# Altium project Altium_Design_Challenge.PrjPcb (part 3 of 3)
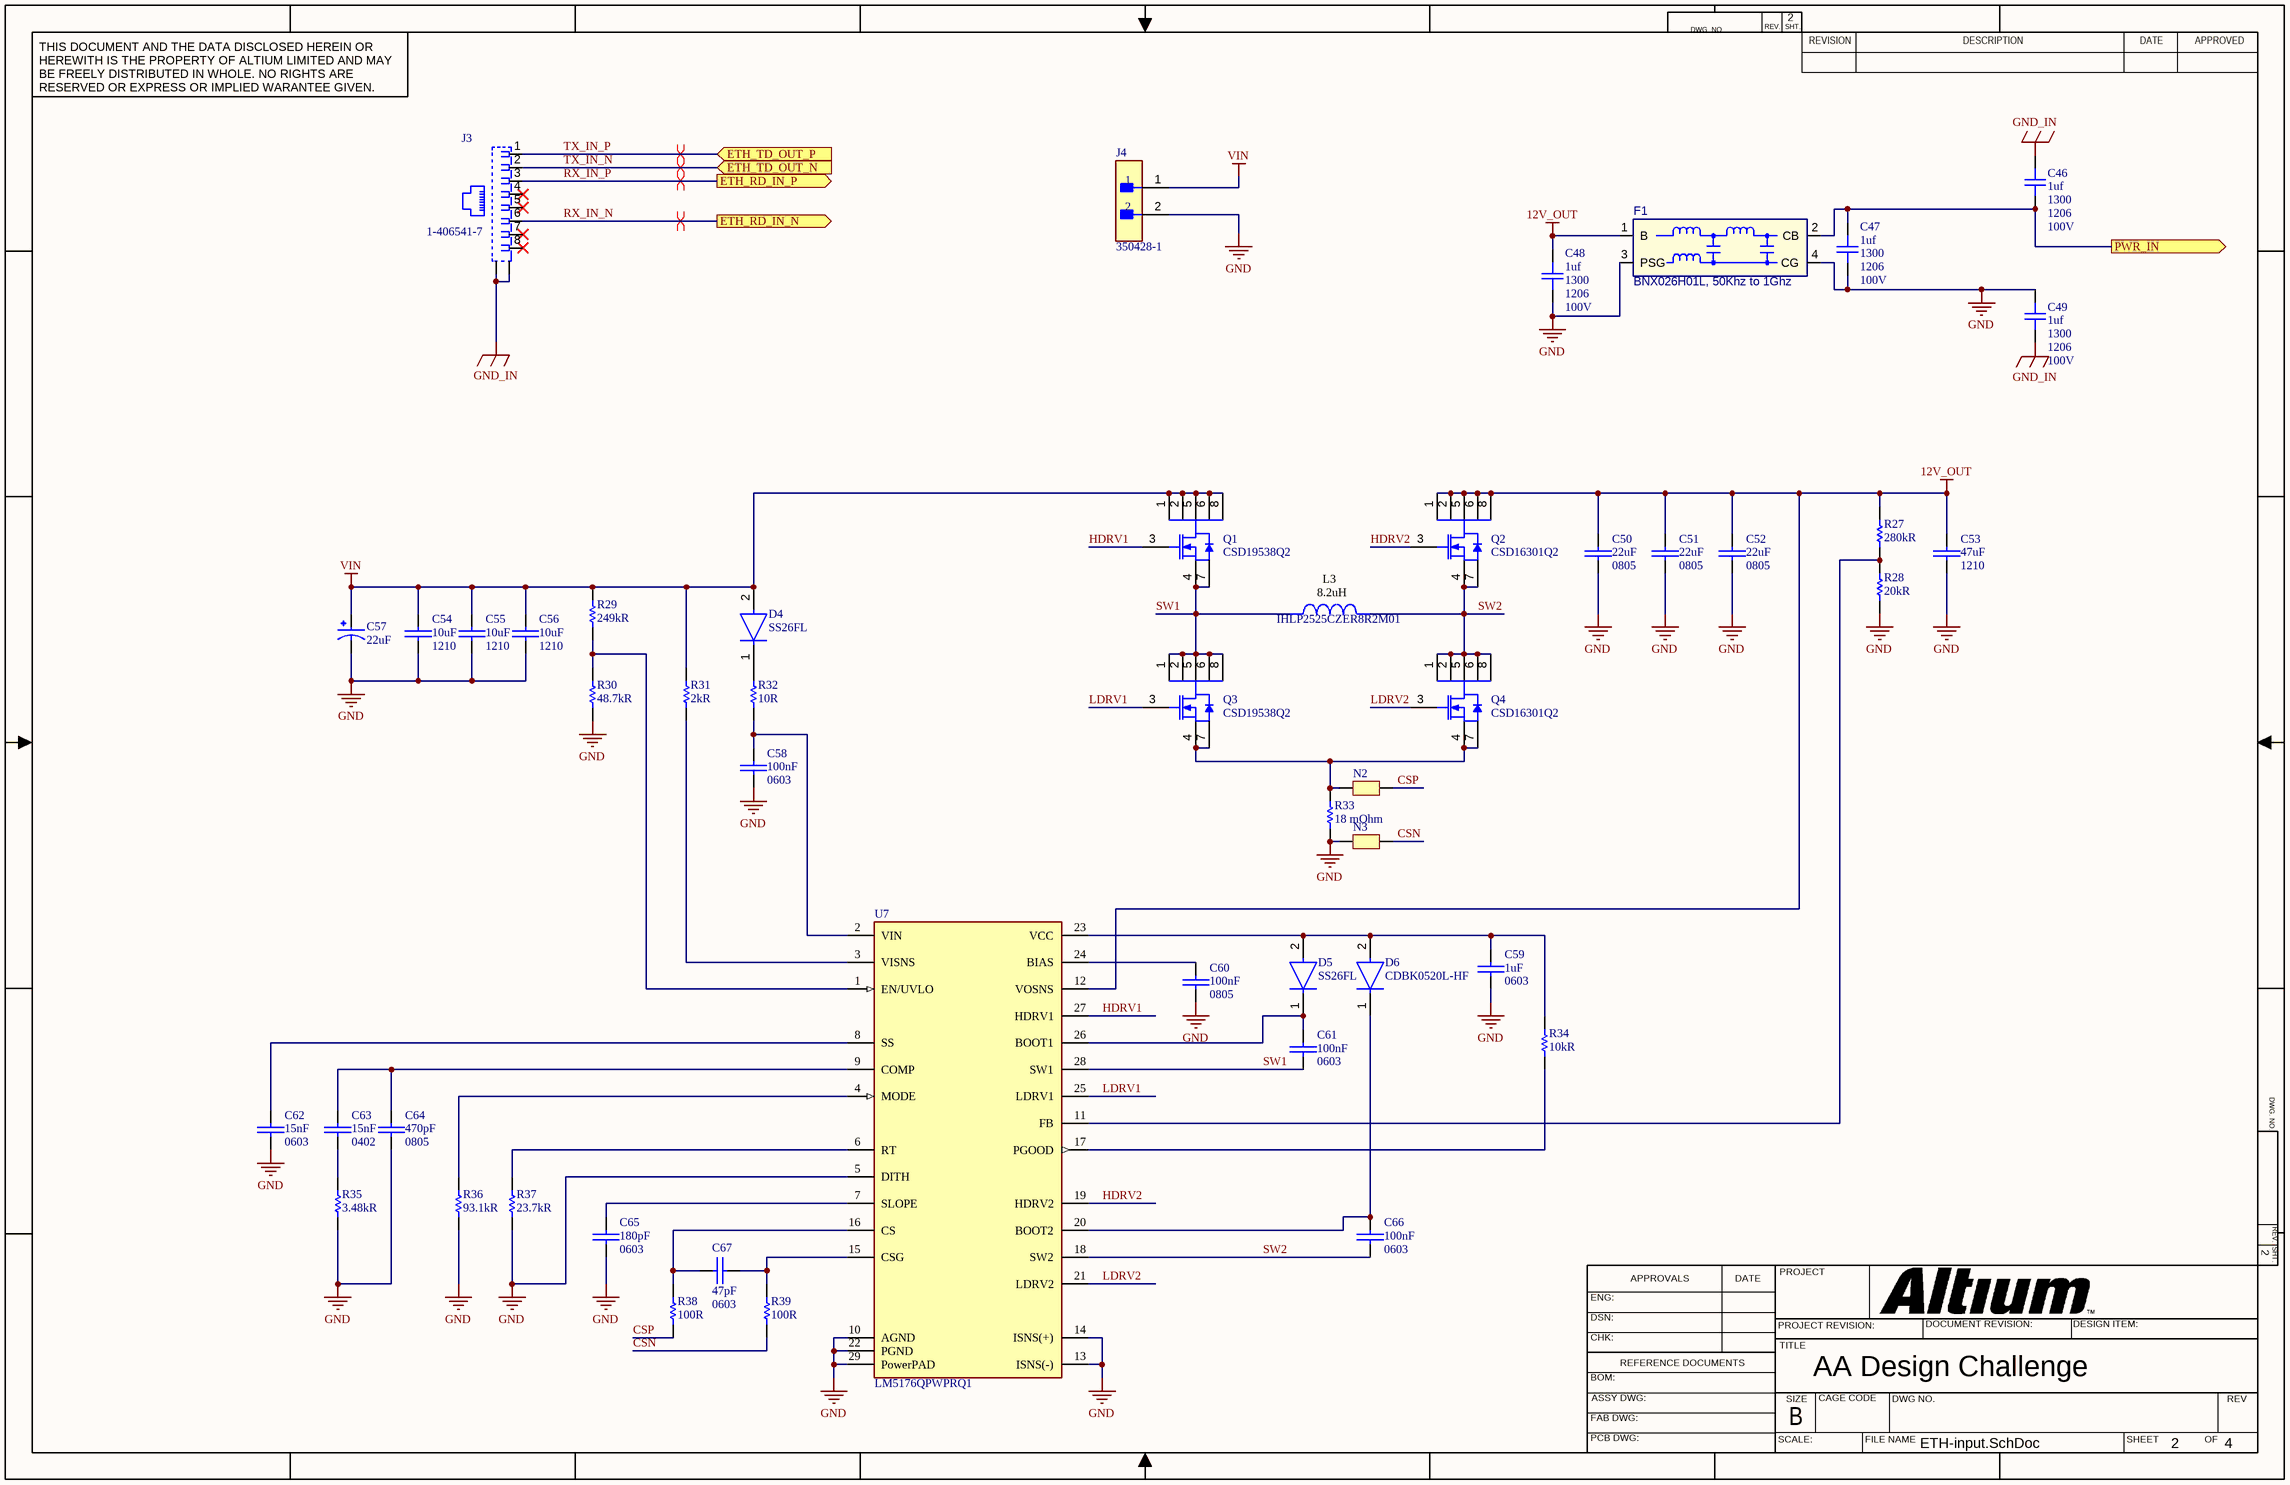
[diagram p6: ETH-input.SchDoc]

## Sheet ETH-input.SchDoc: AA Design Challenge (continued)

### Library data of the parts (continued)
R31 = RES SMD 2K OHM 1% 1/10W 0603: Res Thick Film 0603 2K Ohm 1% 1/10W ±100ppm/°C Molded SMD Paper T/R; Manufacturer: Vishay; Manufacturer Part Number: CRCW06032K00FKEB; Power Rating: 100mW; Voltage Rating: 75V; Supplier: Digi-Key; Supplier Part Number: 541-2.00KHCT-ND; RoHS: Yes; Category: Chip SMD Resistors; Stock: 30000; Pricing: 1=0.10000, 10=0.03400, 50=0.01860, 100=0.01370, 500=0.00836, 1000=0.00616 (USD); Case/Package: 0603; Pins: 2; Contact Plating: Tin; Weight: 7.1E-05oz; Case Code (Imperial): 0603; Case Code (Metric): 1608; Min Operating Temperature: -55°C; Max Operating Temperature: 155°C; Termination: SMD/SMT; Tolerance: 1%; Packaging: Tape and Reel; Package Quantity: 10; Value: 2kR; Temperature Coefficient: 100ppm/°C; Series: CRCW; Resistor Type: Thick Film; Number of Terminations: 2; Max Power Dissipation: 100mW; Features: Automotive AEC-Q200; Construction: Rectangular; Technology: THICK FILM; Voltage Rating (DC): 75V; Resistance Tolerance: 1%; Length: 1.55mm; Width: 0.033inch; Height: 0.45mm; Depth: 0.85mm; Lead Free: Lead Free; RoHS Compliant: Yes; Military Standard: Not; Reach SVHC Compliant: Unknown; ComponentLink1URL: https://datasheet.ciiva.com/28621/125364-28621397.pdf?src-supplier=Element14; ComponentLink1Description: https://datasheet.ciiva.com/28621/125364-28621397.pdf?src-supplier=Element14; ComponentLink2URL: https://datasheet.ciiva.com/7673/1720486-7673525.pdf?src-supplier=Element14; ComponentLink2Description: https://datasheet.ciiva.com/7673/1720486-7673525.pdf?src-supplier=Element14; ComponentLink3URL: https://datasheet.ciiva.com/26314/fld-crcw-e3-data-en-26314682.pdf?src-supplier=Distrelec; ComponentLink3Description: https://datasheet.ciiva.com/26314/fld-crcw-e3-data-en-26314682.pdf?src-supplier=Distrelec; ComponentLink4URL: https://datasheet.ciiva.com/2465/dcrcwe3-2465565.pdf?src-supplier=Digi-Key; ComponentLink4Description: https://datasheet.ciiva.com/2465/dcrcwe3-2465565.pdf?src-supplier=Digi-Key; ComponentLink5URL: https://datasheet.ciiva.com/2465/dcrcwe3-2465566.pdf?src-supplier=Digi-Key; ComponentLink5Description: https://datasheet.ciiva.com/2465/dcrcwe3-2465566.pdf?src-supplier=Digi-Key; ComponentLink6URL: https://datasheet.ciiva.com/2465/dcrcwe3-2465564.pdf?src-supplier=Digi-Key; ComponentLink6Description: https://datasheet.ciiva.com/2465/dcrcwe3-2465564.pdf?src-supplier=Digi-Key; ComponentLink7URL: https://datasheet.ciiva.com/16755/70201119-16755770.pdf?src-supplier=Allied+Electronics; ComponentLink7Description: https://datasheet.ciiva.com/16755/70201119-16755770.pdf?src-supplier=Allied+Electronics; ComponentLink8URL: https://datasheet.ciiva.com/16765/70201119-16765388.pdf?src-supplier=Allied+Electronics; ComponentLink8Description: https://datasheet.ciiva.com/16765/70201119-16765388.pdf?src-supplier=Allied+Electronics; ComponentLink9URL: https://datasheet.ciiva.com/5551/dcrcwe3-109170-5551994.pdf?src-supplier=Mouser; ComponentLink9Description: https://datasheet.ciiva.com/5551/dcrcwe3-109170-5551994.pdf?src-supplier=Mouser; ComponentLink10URL: https://datasheet.ciiva.com/3257/dcrcwe3-3257366.pdf?src-supplier=Avnet; ComponentLink10Description: https://datasheet.ciiva.com/3257/dcrcwe3-3257366.pdf?src-supplier=Avnet; ComponentLink11URL: https://datasheet.ciiva.com/3257/dcrcwe3-3257367.pdf?src-supplier=Avnet; ComponentLink11Description: https://datasheet.ciiva.com/3257/dcrcwe3-3257367.pdf?src-supplier=Avnet
R32 = RES SMD 2K OHM 1% 1/10W 0603: Res Thick Film 0603 10 Ohm 1% 1/10W ±200ppm/°C Molded SMD Paper T/R; Manufacturer: Yageo; Manufacturer Part Number: RC0603FR-0710RL; Voltage Rating (DC): 50V; Max Power Dissipation: 100mW; Supplier: Digi-Key; Supplier Part Number: 311-10.0HRCT-ND; RoHS: Yes; Category: Chip SMD Resistors; Stock: 3052109; Pricing: 1=0.10000, 10=0.03000, 50=0.01900, 100=0.01600, 500=0.01106, 1000=0.00957 (USD); Case/Package: 0603; Pins: 2; Case Code (Imperial): 0603; Case Code (Metric): 1608; Contact Plating: Tin,Matte; Min Operating Temperature: -55°C; Max Operating Temperature: 155°C; Packaging: Tape and Reel; Value: 10R; Tolerance: 1%; Temperature Coefficient: 200ppm/°C; Series: RC; Number of Terminations: 2; Features: Moisture Resistant; Power Rating: 100mW; Voltage Rating: 50V; Termination: SMD/SMT; Resistor Type: Thick Film; Resistance Tolerance: 1%; Construction: Rectangular; Technology: THICK FILM; Length: 1.6mm; Width: 0.8mm; Height: 0.45mm; Depth: 0.8mm; Lead Free: Lead Free; RoHS Compliant: Yes; Reach SVHC Compliant: No; Military Standard: Not; ComponentLink1URL: https://datasheet.ciiva.com/11808/0900766b80f96399-11808140.pdf?src-supplier=Rs; ComponentLink1Description: https://datasheet.ciiva.com/11808/0900766b80f96399-11808140.pdf?src-supplier=Rs; ComponentLink2URL: https://datasheet.ciiva.com/8891/pyu-rc0603-51-rohs-l-4-8891285.pdf?src-supplier=Avnet; ComponentLink2Description: https://datasheet.ciiva.com/8891/pyu-rc0603-51-rohs-l-4-8891285.pdf?src-supplier=Avnet; ComponentLink3URL: https://datasheet.ciiva.com/7746/443971-7746245.pdf?src-supplier=Element14; ComponentLink3Description: https://datasheet.ciiva.com/7746/443971-7746245.pdf?src-supplier=Element14
R33 = ERJ8CWFR018V: Res Thick Film 1206 0.018 Ohm 1% 1W ±75ppm/C Pad SMD Automotive T/R; Manufacturer: Panasonic; Manufacturer Part Number: ERJ8CWFR018V; Resistance: 18 mOhm
R34 = RES SMD 2K OHM 1% 1/10W 0603: RES SMD 10K OHM 1% 1/10W 0603; Manufacturer: Yageo; Manufacturer Part Number: RC0603FR-0710KL; Temperature Coefficient: 100ppm/°C; Voltage Rating: 75V; Voltage Rating (DC): 50V; Power Rating: 100mW; Supplier: Digi-Key; Supplier Part Number: 311-10.0KHRCT-ND; RoHS: Yes; Category: Chip SMD Resistors; Stock: 31562313; Pricing: 1=0.10000, 10=0.01900, 50=0.01140, 100=0.00940, 500=0.00628, 1000=0.00537 (USD); Case/Package: 0603; Pins: 2; Case Code (Imperial): 0603; Case Code (Metric): 1608; Weight: 7.1E-05oz; Min Operating Temperature: -55°C; Max Operating Temperature: 155°C; Tolerance: 1%; Resistor Type: Thick Film; Value: 10kR; Packaging: Tape and Reel; Termination: SMD/SMT; Features: Moisture Resistant; Series: RC; Max Power Dissipation: 100mW; Number of Terminations: 2; Resistance Tolerance: 1%; Construction: Rectangular; Length: 1.6mm; Width: 0.8mm; Height: 0.45mm; Depth: 0.8mm; Lead Pitch: 0.3mm; RoHS Compliant: Yes; Reach SVHC Compliant: No; Military Standard: Not; Lead Free: Lead Free; ComponentLink1URL: https://datasheet.ciiva.com/7660/38590-7660789.pdf?src-supplier=Element14; ComponentLink1Description: https://datasheet.ciiva.com/7660/38590-7660789.pdf?src-supplier=Element14; ComponentLink2URL: https://datasheet.ciiva.com/7983/443971-7983596.pdf?src-supplier=Element14; ComponentLink2Description: https://datasheet.ciiva.com/7983/443971-7983596.pdf?src-supplier=Element14; ComponentLink3URL: https://datasheet.ciiva.com/22747/443971-22747519.pdf?src-supplier=Element14; ComponentLink3Description: https://datasheet.ciiva.com/22747/443971-22747519.pdf?src-supplier=Element14; ComponentLink4URL: https://datasheet.ciiva.com/46440/1868787-46440891.pdf?src-supplier=Element14; ComponentLink4Description: https://datasheet.ciiva.com/46440/1868787-46440891.pdf?src-supplier=Element14; ComponentLink5URL: https://datasheet.ciiva.com/7746/1738695-7746239.pdf?src-supplier=Element14; ComponentLink5Description: https://datasheet.ciiva.com/7746/1738695-7746239.pdf?src-supplier=Element14; ComponentLink6URL: https://datasheet.ciiva.com/15189/getdatasheetpartid-409289-15189591.pdf?src-supplier=Verical; ComponentLink6Description: https://datasheet.ciiva.com/15189/getdatasheetpartid-409289-15189591.pdf?src-supplier=Verical
R35 = RES SMD 2K OHM 1% 1/10W 0603: Res Thick Film 0402 3.48K Ohm 1% 1/16W ±100ppm/°C Molded SMD Paper T/R; Manufacturer: Vishay; Manufacturer Part Number: CRCW04023K48FKED; Max Power Dissipation: 63mW; Voltage Rating: 50V; Supplier: Digi-Key; Supplier Part Number: 541-3.48KLCT-ND; RoHS: Yes; Category: Chip SMD Resistors; Stock: 10000; Pricing: 1=0.10000, 10=0.03300, 50=0.01820, 100=0.01340, 500=0.00818, 1000=0.00602, 5000=0.00432 (USD); Case/Package: 0402; Pins: 2; Weight: 2.3E-05oz; Case Code (Imperial): 0402; Case Code (Metric): 1005; Contact Plating: Tin; Min Operating Temperature: -55°C; Max Operating Temperature: 155°C; Value: 3.48kR; Tolerance: 1%; Packaging: Tape and Reel; Package Quantity: 10000; Number of Terminations: 2; Temperature Coefficient: 100ppm/°C; Features: Automotive AEC-Q200; Series: CRCW; Power Rating: 63mW; Resistor Type: Thick Film; Termination: SMD/SMT; Technology: THICK FILM; Resistance Tolerance: 1%; Length: 1mm; Width: 0.5mm; Height: 0.35mm; Depth: 0.5mm; Ratings: AEC-Q200; Radiation Hardening: No; RoHS Compliant: Yes; Reach SVHC Compliant: Unknown; ComponentLink1URL: https://datasheet.ciiva.com/11818/0900766b80d98824-11818064.pdf?src-supplier=Rs; ComponentLink1Description: https://datasheet.ciiva.com/11818/0900766b80d98824-11818064.pdf?src-supplier=Rs; ComponentLink2URL: https://datasheet.ciiva.com/3256/dcrcwe3-3256488.pdf?src-supplier=Avnet; ComponentLink2Description: https://datasheet.ciiva.com/3256/dcrcwe3-3256488.pdf?src-supplier=Avnet; ComponentLink3URL: https://datasheet.ciiva.com/3256/dcrcwe3-3256489.pdf?src-supplier=Avnet; ComponentLink3Description: https://datasheet.ciiva.com/3256/dcrcwe3-3256489.pdf?src-supplier=Avnet; ComponentLink4URL: https://datasheet.ciiva.com/2463/dcrcwe3-2463514.pdf?src-supplier=Digi-Key; ComponentLink4Description: https://datasheet.ciiva.com/2463/dcrcwe3-2463514.pdf?src-supplier=Digi-Key; ComponentLink5URL: https://datasheet.ciiva.com/2463/dcrcwe3-2463515.pdf?src-supplier=Digi-Key; ComponentLink5Description: https://datasheet.ciiva.com/2463/dcrcwe3-2463515.pdf?src-supplier=Digi-Key; ComponentLink6URL: https://datasheet.ciiva.com/2463/dcrcwe3-2463516.pdf?src-supplier=Digi-Key; ComponentLink6Description: https://datasheet.ciiva.com/2463/dcrcwe3-2463516.pdf?src-supplier=Digi-Key; ComponentLink7URL: https://datasheet.ciiva.com/5546/dcrcwe3-109170-5546917.pdf?src-supplier=Mouser; ComponentLink7Description: https://datasheet.ciiva.com/5546/dcrcwe3-109170-5546917.pdf?src-supplier=Mouser; ComponentLink8URL: https://datasheet.ciiva.com/7670/1697337-7670197.pdf?src-supplier=Element14; ComponentLink8Description: https://datasheet.ciiva.com/7670/1697337-7670197.pdf?src-supplier=Element14; ComponentLink9URL: https://datasheet.ciiva.com/7670/1697337-7670198.pdf?src-supplier=Element14; ComponentLink9Description: https://datasheet.ciiva.com/7670/1697337-7670198.pdf?src-supplier=Element14; ComponentLink10URL: https://datasheet.ciiva.com/22707/1697337-22707727.pdf?src-supplier=Element14; ComponentLink10Description: https://datasheet.ciiva.com/22707/1697337-22707727.pdf?src-supplier=Element14; ComponentLink11URL: https://datasheet.ciiva.com/16449/dcrcwe3-16449546.pdf?src-supplier=Future+Electronics; ComponentLink11Description: https://datasheet.ciiva.com/16449/dcrcwe3-16449546.pdf?src-supplier=Future+Electronics; ComponentLink12URL: https://datasheet.ciiva.com/22869/70201119-22869978.pdf?src-supplier=Allied+Electronics; ComponentLink12Description: https://datasheet.ciiva.com/22869/70201119-22869978.pdf?src-supplier=Allied+Electronics
R36 = RES SMD 2K OHM 1% 1/10W 0603: Res Thick Film 0603 93.1K Ohm 1% 1/10W ±100ppm/°C Molded SMD SMD Paper T/R; Manufacturer: Yageo; Manufacturer Part Number: RC0603FR-0793K1L; Power Rating: 100mW; Voltage Rating: 50V; Working Voltage: 75V; Supplier: Digi-Key; Supplier Part Number: 311-93.1KHRCT-ND; RoHS: Yes; Category: Chip SMD Resistors; Stock: 14645; Pricing: 1=0.10000, 10=0.01900, 50=0.01140, 100=0.00940, 500=0.00628, 1000=0.00537 (USD); Case/Package: 0603; Contact Plating: Tin,Matte; Case Code (Imperial): 0603; Case Code (Metric): 1608; Min Operating Temperature: -55°C; Max Operating Temperature: 155°C; Tolerance: 1%; Value: 93.1kR; Temperature Coefficient: 100ppm/°C; Package Quantity: 1; Packaging: Tape and Reel; Termination: SMD/SMT; Number of Terminations: 2; Max Power Dissipation: 100mW; Voltage Rating (DC): 50V; Features: Moisture Resistant; Series: RC; Technology: THICK FILM; Length: 0.063inch; Width: 0.031inch; Height: 0.022inch; Lead Free: Lead Free; RoHS Compliant: Yes; ComponentLink1URL: https://datasheet.ciiva.com/2455/pyu-r-int-thick-7-2455339.pdf?src-supplier=Digi-Key; ComponentLink1Description: https://datasheet.ciiva.com/2455/pyu-r-int-thick-7-2455339.pdf?src-supplier=Digi-Key; ComponentLink2URL: https://datasheet.ciiva.com/2455/pyu-r-int-thick-7-2455340.pdf?src-supplier=Digi-Key; ComponentLink2Description: https://datasheet.ciiva.com/2455/pyu-r-int-thick-7-2455340.pdf?src-supplier=Digi-Key; ComponentLink3URL: https://datasheet.ciiva.com/2455/pyu-r-int-thick-7-2455338.pdf?src-supplier=Digi-Key; ComponentLink3Description: https://datasheet.ciiva.com/2455/pyu-r-int-thick-7-2455338.pdf?src-supplier=Digi-Key
R37 = RES SMD 2K OHM 1% 1/10W 0603: Res General Purpose Thick Film 0201 23.7k Ohm 1% 1/20W ±200ppm/°C Molded SMD Paper T/R; Manufacturer: Yageo; Manufacturer Part Number: RC0201FR-0723K7L; Max Power Dissipation: 50mW; Supplier: Digi-Key; Supplier Part Number: YAG2524CT-ND; RoHS: Yes; Category: Chip SMD Resistors; Stock: 105811; Pricing: 1=0.10000, 10=0.02700, 50=0.01720, 100=0.01450, 500=0.00998, 1000=0.00863, 5000=0.00635 (USD); Case/Package: 0201; Case Code (Metric): 0603; Case Code (Imperial): 0201; Min Operating Temperature: -55°C; Max Operating Temperature: 125°C; Packaging: Cut Tape; Value: 23.7kR; Number of Terminations: 2; Tolerance: 1%; Temperature Coefficient: 200ppm/°C; Features: Moisture Resistant; Series: RC; Lead Free: Lead Free; RoHS Compliant: Yes; ComponentLink1URL: http://www.yageo.com/documents/recent/PYu-RC_Group_51_RoHS_L_9.pdf?src-supplier=Digi-Key; ComponentLink1Description: http://www.yageo.com/documents/recent/PYu-RC_Group_51_RoHS_L_9.pdf?src-supplier=Digi-Key
R38 R39 = RES SMD 2K OHM 1% 1/10W 0603: Res Thick Film 0603 100 Ohm 1% 1/10W ±100ppm/°C Molded SMD Paper T/R; Manufacturer: Vishay Dale; Manufacturer Part Number: CRCW0603100RFKEA; Power Rating: 100mW; Voltage Rating: 75V; Supplier: Avnet; Supplier Part Number: CRCW0603100RFKEA; RoHS: Yes; Category: Chip SMD Resistors; Stock: 335000; Pricing: 5000=0.01943, 10000=0.01838, 20000=0.01733, 30000=0.01628, 40000=0.01523 (USD); Case/Package: 0603; Pins: 2; Weight: 7.1E-05oz; Case Code (Metric): 1608; Case Code (Imperial): 0603; Min Operating Temperature: -55°C; Max Operating Temperature: 155°C; Value: 100R; Tolerance: 1%; Resistor Type: Thick Film; Package Quantity: 10; Packaging: Tape and Reel; Number of Terminations: 2; Termination: SMD/SMT; Temperature Coefficient: 100ppm/°C; Max Power Dissipation: 100mW; Voltage Rating (DC): 75V; Features: Automotive AEC-Q200; Series: CRCW; Resistance Tolerance: 1%; Construction: Rectangular; Length: 1.55mm; Width: 0.033inch; Height: 0.02inch; Depth: 0.85mm; Ratings: AEC-Q200; Lead Free: Lead Free; RoHS Compliant: Yes; Reach SVHC Compliant: Unknown; Military Standard: Not; ComponentLink1URL: https://datasheet.ciiva.com/22666/1720486-22666207.pdf?src-supplier=Element14; ComponentLink1Description: https://datasheet.ciiva.com/22666/1720486-22666207.pdf?src-supplier=Element14; ComponentLink2URL: https://datasheet.ciiva.com/26316/fld-crcw-e3-data-en-26316566.pdf?src-supplier=Distrelec; ComponentLink2Description: https://datasheet.ciiva.com/26316/fld-crcw-e3-data-en-26316566.pdf?src-supplier=Distrelec; ComponentLink3URL: https://datasheet.ciiva.com/22673/1697337-22673066.pdf?src-supplier=Element14; ComponentLink3Description: https://datasheet.ciiva.com/22673/1697337-22673066.pdf?src-supplier=Element14; ComponentLink4URL: https://datasheet.ciiva.com/2465/dcrcwe3-2465544.pdf?src-supplier=Digi-Key; ComponentLink4Description: https://datasheet.ciiva.com/2465/dcrcwe3-2465544.pdf?src-supplier=Digi-Key; ComponentLink5URL: https://datasheet.ciiva.com/2465/dcrcwe3-2465545.pdf?src-supplier=Digi-Key; ComponentLink5Description: https://datasheet.ciiva.com/2465/dcrcwe3-2465545.pdf?src-supplier=Digi-Key; ComponentLink6URL: https://datasheet.ciiva.com/2465/dcrcwe3-2465543.pdf?src-supplier=Digi-Key; ComponentLink6Description: https://datasheet.ciiva.com/2465/dcrcwe3-2465543.pdf?src-supplier=Digi-Key; ComponentLink7URL: https://datasheet.ciiva.com/16721/70201119-16721486.pdf?src-supplier=Allied+Electronics; ComponentLink7Description: https://datasheet.ciiva.com/16721/70201119-16721486.pdf?src-supplier=Allied+Electronics; ComponentLink8URL: https://datasheet.ciiva.com/16787/70201119-16787964.pdf?src-supplier=Allied+Electronics; ComponentLink8Description: https://datasheet.ciiva.com/16787/70201119-16787964.pdf?src-supplier=Allied+Electronics; ComponentLink9URL: https://datasheet.ciiva.com/5550/dcrcwe3-109170-5550286.pdf?src-supplier=Mouser; ComponentLink9Description: https://datasheet.ciiva.com/5550/dcrcwe3-109170-5550286.pdf?src-supplier=Mouser; ComponentLink10URL: https://datasheet.ciiva.com/16199/dcrcwe3-16199102.pdf?src-supplier=Future+Electronics; ComponentLink10Description: https://datasheet.ciiva.com/16199/dcrcwe3-16199102.pdf?src-supplier=Future+Electronics
U7 = LM5176QPWPRQ1: 55-V wide VIN synchronous 4-switch buck-boost controller, AEC-Q100 qualified 28-HTSSOP -40 to 125; Manufacturer: Texas Instruments; Supplier: Mouser; Supplier Part Number: 595-LM5176QPWPRQ1; Manufacturer Part Number: LM5176QPWPRQ1; RoHS: Yes; Category: Voltage Regulators - Switching; Stock: 10548; Pricing: 1=8.65000, 10=7.81000, 50=7.45000, 100=6.47000, 1000=5.14000, 10000=5.06000 (USD); RoHS Compliant: Yes

## Nets that join several sheets
3V3D: PIC Microcontroller (17 pins), Power,Sensors (9 pins)
AVD3V3: PIC Microcontroller (8 pins), Termination,connector (14 pins)
GND: Block Diagram (5 pins), PIC Microcontroller (35 pins), Power,Sensors (22 pins), Termination,connector (11 pins), ETH-input (33 pins)
GND_IN: Termination,connector (C42.2 C43.1 C44.1), ETH-input (C46.1 C49.1 J3.9 J3.10)
PWN_IN: Power,Sensors (5 pins), ETH-input (C46.2 C47.1 F1.2)
NetC21_2: PIC Microcontroller (U1.35), Power,Sensors (C21.2 R5.2)
NetR11_2: PIC Microcontroller (U1.53), Power,Sensors (R11.2)
NetR13_1: PIC Microcontroller (U1.33), Power,Sensors (R13.1 R14.2)
NetR16_2: PIC Microcontroller (U1.6), Power,Sensors (R16.2 U4.5)
RD_IN_N: PIC Microcontroller (U1.73), Termination,connector (R21.2 T1.8 U6.3 U6.4)
RD_IN_P: PIC Microcontroller (U1.74), Termination,connector (R20.1 T1.6 U6.1 U6.5)
RX_IN_N: Termination,connector (D3.1 D3.8 T1.9), ETH-input (J3.6)
RX_IN_P: Termination,connector (D3.4 D3.5 T1.11), ETH-input (J3.3)
SHUT: Block Diagram (R24.2 R26.1), PIC Microcontroller (U1.34)
TD_IN_N: PIC Microcontroller (U1.77), Termination,connector (R19.2 T1.3 U5.3 U5.4)
TD_IN_P: PIC Microcontroller (U1.78), Termination,connector (R18.1 T1.1 U5.1 U5.5)
TX_IN_N: Termination,connector (D2.1 D2.8 T1.14), ETH-input (J3.2)
TX_IN_P: Termination,connector (D2.4 D2.5 T1.16), ETH-input (J3.1)